# Altium schematic sheet [07] - RS232.SchDoc
size A3; DocumentNumber: 8; SheetNumber: 8; SheetTotal: 12
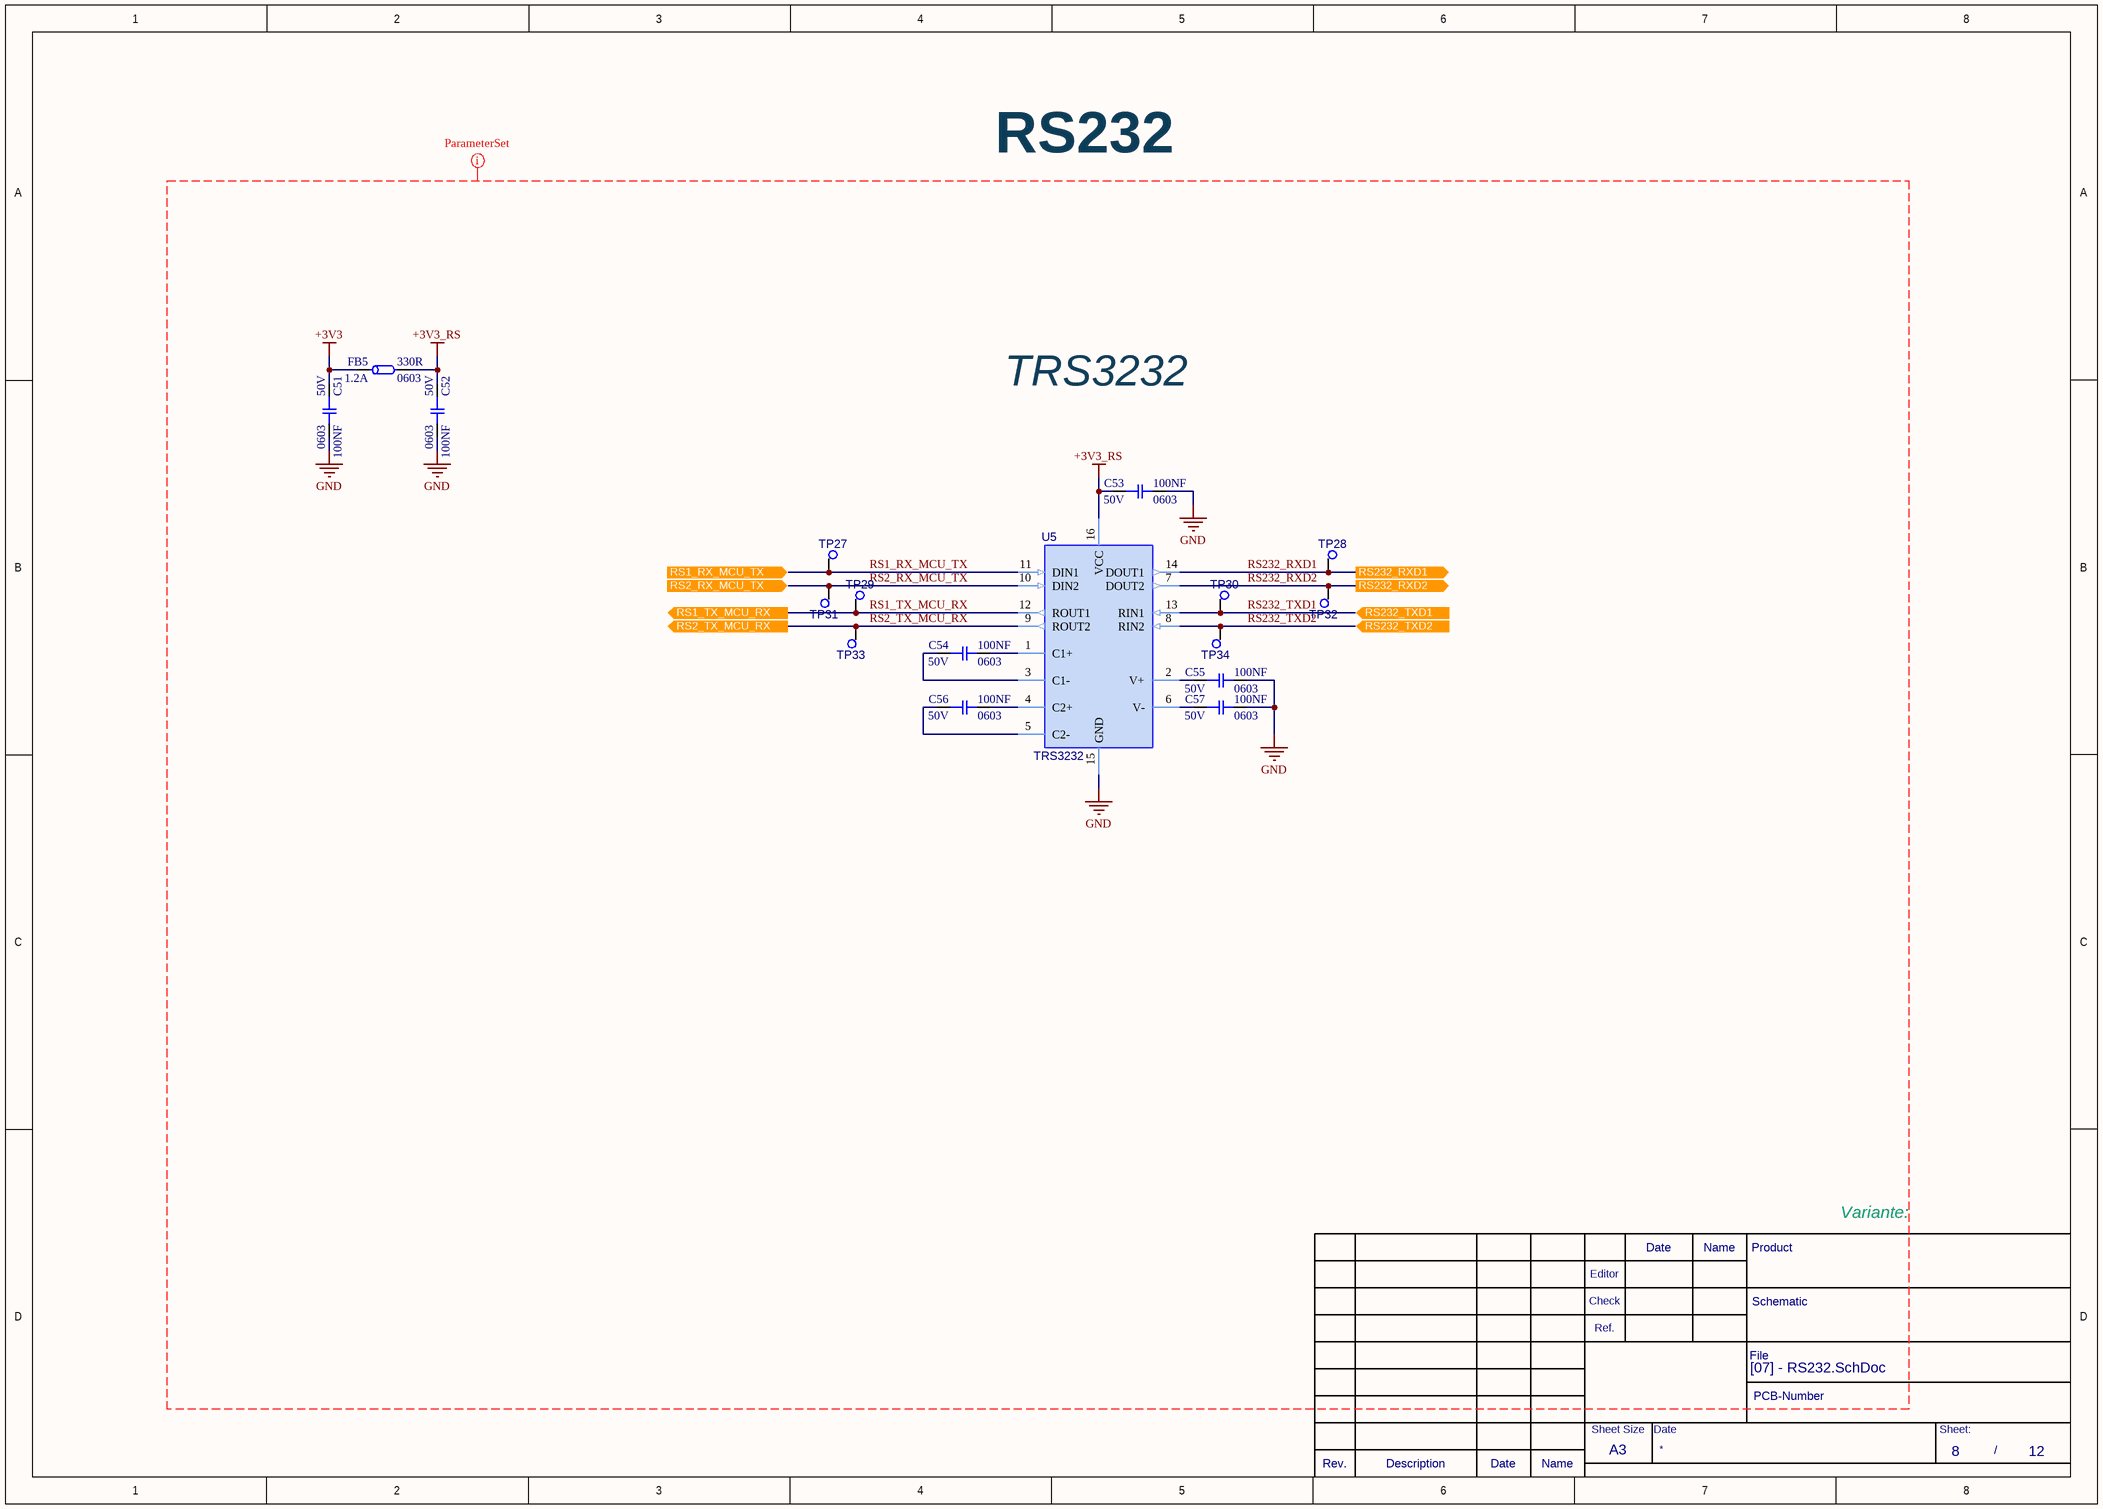
[diagram p0: [07] - RS232.SchDoc]

## Parts
C51  100NF  Voltage Rating: 50V  Case Code (Imperial): 0603  [C-0603]
C52  100NF  Voltage Rating: 50V  Case Code (Imperial): 0603  [C-0603]
C53  100NF  Voltage Rating: 50V  Case Code (Imperial): 0603  [C-0603]
C54  100NF  Voltage Rating: 50V  Case Code (Imperial): 0603  [C-0603]
C55  100NF  Voltage Rating: 50V  Case Code (Imperial): 0603  [C-0603]
C56  100NF  Voltage Rating: 50V  Case Code (Imperial): 0603  [C-0603]
C57  100NF  Voltage Rating: 50V  Case Code (Imperial): 0603  [C-0603]
FB5  330R  Case/Package: 0603  DC Current: 1.2A  [FB-0603]
TP27  MECH-TESTPOINT  [MECH-TESTPOINT]  (value not drawn)  (no BOM)
TP28  MECH-TESTPOINT  [MECH-TESTPOINT]  (value not drawn)  (no BOM)
TP29  MECH-TESTPOINT  [MECH-TESTPOINT]  (value not drawn)  (no BOM)
TP30  MECH-TESTPOINT  [MECH-TESTPOINT]  (value not drawn)  (no BOM)
TP31  MECH-TESTPOINT  [MECH-TESTPOINT]  (value not drawn)  (no BOM)
TP32  MECH-TESTPOINT  [MECH-TESTPOINT]  (value not drawn)  (no BOM)
TP33  MECH-TESTPOINT  [MECH-TESTPOINT]  (value not drawn)  (no BOM)
TP34  MECH-TESTPOINT  [MECH-TESTPOINT]  (value not drawn)  (no BOM)
U5  TRS3232  [TSSOP16]

## Ports
RS1_RX_MCU_TX (in), RS1_TX_MCU_RX (out), RS2_RX_MCU_TX (in), RS2_TX_MCU_RX (out), RS232_RXD1 (out), RS232_RXD2 (out), RS232_TXD1 (in), RS232_TXD2 (in)

## Nets
+3V3: C51.1 FB5.1
+3V3_RS: C52.1 C53.1 FB5.2 U5.16(VCC)
GND: C51.2 C52.2 C53.2 C55.2 C57.2 U5.15(GND)
RS1_RX_MCU_TX: TP27.1 U5.11(DIN1) ; port RS1_RX_MCU_TX
RS1_TX_MCU_RX: TP29.1 U5.12(ROUT1) ; port RS1_TX_MCU_RX
RS2_RX_MCU_TX: TP31.1 U5.10(DIN2) ; port RS2_RX_MCU_TX
RS2_TX_MCU_RX: TP33.1 U5.9(ROUT2) ; port RS2_TX_MCU_RX
RS232_RXD1: TP28.1 U5.14(DOUT1) ; port RS232_RXD1
RS232_RXD2: TP32.1 U5.7(DOUT2) ; port RS232_RXD2
RS232_TXD1: TP30.1 U5.13(RIN1) ; port RS232_TXD1
RS232_TXD2: TP34.1 U5.8(RIN2) ; port RS232_TXD2
NetC54_1: C54.1 U5.3(C1-)
NetC54_2: C54.2 U5.1(C1+)
NetC55_1: C55.1 U5.2(V+)
NetC56_1: C56.1 U5.5(C2-)
NetC56_2: C56.2 U5.4(C2+)
NetC57_1: C57.1 U5.6(V-)

## Layout directives
net class RS232: +3V3, +3V3_RS, GND, RS1_RX_MCU_TX, RS1_TX_MCU_RX, RS2_RX_MCU_TX, RS2_TX_MCU_RX, RS232_RXD1, RS232_RXD2, RS232_TXD1, RS232_TXD2

## Notes on the sheet
- RS232
- TRS3232
- Date
- Name
- Product
- Variante:
- Editor
- Check
- Ref.
- Schematic
- File
- PCB-Number
- Rev.
- Description
- Sheet Size
- A3
- Sheet:
- /

## Library data of the parts
C51-C57 = C-100NF-0603: CAP CER 0.1UF 50V X7R 0603; Manufacturer: TDK; Manufacturer Part Number: C1608X7R1H104K080AA; Tolerance: 10%; Dielectric Material: Ceramic; .PCBCHK: USED; .Creator: F:TALI; Washability: OK; Temperature Coefficient: 30ppm/°C; Mount: Surface Mount; Case/Package: 0603; Case Code (Metric): 1608; Min Operating Temperature: -55°C; Max Operating Temperature: 125°C; Package Quantity: 1; Packaging: Tape and Reel; Features: Soft Termination; Length: 1.6mm; Width: 0.8mm; Thickness: 0.037inch; Lead Free: Lead Free; Capacitance: 100nF; Supplier 1: Digi-Key; Supplier Part Number 1: 445-1314-1-ND; Stock 1: 0; Pricing 1: 1=0.1, 10=0.057, 100=0.0254, 500=0.01812, 1000=0.01423 (USD); Contact Plating: Matte,Tin; Voltage Rating (DC): 50V; Dielectric: X7R; Termination: SMD/SMT; Voltage: 50V; Height: 0.8mm; Depth: 0.8mm; REACH SVHC: No SVHC; ComponentLink1URL: http://www.mouser.com/ds/2/400/lcc_commercial_general_en-837201.pdf; ComponentLink1Description: http://www.mouser.com/ds/2/400/lcc_commercial_general_en-837201.pdf; ComponentLink2URL: https://product.tdk.com/info/en/catalog/spec/mlccspec_commercial_general_midvoltage_en.pdf; ComponentLink2Description: https://product.tdk.com/info/en/catalog/spec/mlccspec_commercial_general_midvoltage_en.pdf; Supplier 2: Digi-Key; Supplier Part Number 2: 478-3540-6-ND; Stock 2: 40000; Pricing 2: 1=0.23, 10=0.161, 100=0.0756, 500=0.05304, 1000=0.0439 (USD); Number of Pins: 2; Radiation Hardening: No; ComponentLink3URL: http://uk.rs-online.com/webdocs/13d1/0900766b813d1103.pdf; ComponentLink3Description: http://uk.rs-online.com/webdocs/13d1/0900766b813d1103.pdf; ComponentLink4URL: http://www.tdk.co.jp/tefe02/e412_c.pdf; ComponentLink4Description: http://www.tdk.co.jp/tefe02/e412_c.pdf; ComponentLink5URL: http://www.farnell.com/datasheets/2291921.pdf; ComponentLink5Description: http://www.farnell.com/datasheets/2291921.pdf; ComponentLink6URL: http://www.farnell.com/datasheets/1744655.pdf; ComponentLink6Description: http://www.farnell.com/datasheets/1744655.pdf; ComponentLink7URL: http://catalogs.avx.com/SurfaceMount.pdf; ComponentLink7Description: http://catalogs.avx.com/SurfaceMount.pdf; ComponentLink8URL: http://www.farnell.com/datasheets/630895.pdf; ComponentLink8Description: http://www.farnell.com/datasheets/630895.pdf; ComponentLink9URL: http://www.avx.com/docs/Catalogs/cx7r.pdf; ComponentLink9Description: http://www.avx.com/docs/Catalogs/cx7r.pdf; ComponentLink10URL: http://www.avx.com/docs/catalogs/cauto.pdf; ComponentLink10Description: http://www.avx.com/docs/catalogs/cauto.pdf; .SCHCHK: USED; Weight: 7.1E-05oz; Composition: Ceramic; ComponentLink11URL: https://www.verical.com/server-webapp/html/getDatasheet?partID=98691; ComponentLink11Description: https://www.verical.com/server-webapp/html/getDatasheet?partID=98691; ComponentLink12URL: https://www.avx.com/docs/Catalogs/flexiterm.pdf; ComponentLink12Description: https://www.avx.com/docs/Catalogs/flexiterm.pdf
FB5 = FB-330R-0603: FERRITE BEAD 330 OHM 0603 1LN; Manufacturer: Murata; Manufacturer Part Number: BLM18PG331SN1D; Material: Steel,Ferrite; Tolerance: 25%; DC Resistance (DCR): 150mR; Number of Lines: 1; Test Frequency: 100MHz; Shielding: Unshielded; Washability: OK; .Creator: M.OZKAN; .PCBCHK: USED; Supplier 1: Digi-Key; RoHS: Yes; Number of Pins: 2; Core Material: Ferrite; Case Code (Metric): 1608; Case Code (Imperial): 0603; Min Operating Temperature: -55°C; Max Operating Temperature: 125°C; Impedance: 330R; Package Quantity: 1; Packaging: Tape and Reel; Current Rating: 1.2A; Max Current Rating: 1.2A; Termination: SMD/SMT; Number of Circuits: 1; Length: 1.75mm; Height: 0.8mm; Width: 0.8mm; Depth: 0.95mm; Radiation Hardening: No; REACH SVHC: No SVHC; Lead Free: Lead Free; ComponentLink1URL: https://datasheet.ciiva.com/6211/enfa0003-6211710.pdf?src-supplier=Digi-Key; ComponentLink1Description: https://datasheet.ciiva.com/6211/enfa0003-6211710.pdf?src-supplier=Digi-Key; Supplier Part Number 1: 490-5222-1-ND; Max DC Current: 1.2A; .SCHCHK: USED; Stock: 106218; Pricing: 1=0.1, 10=0.076, 25=0.0684, 50=0.05, 100=0.0433, 250=0.0342, 500=0.0288, 1000=0.0243 (USD)
TP27-TP34 = MECH-TESTPOINT: .PCBCHK: USED; .Creator: F:TALI; Washability: OK; .SCHCHK: USED
U5 = IC-TRS3232ECPWR: IC TRANSCEIVER FULL 2/2 16TSSOP; Manufacturer 1: Texas Instruments; Number of Receivers: 2; Data Rate: 250Kbps; Max Supply Voltage: 5.5V; Min Supply Voltage: 3V; Nominal Supply Current: 1mA; Logic Function: Transceiver,Receiver; Number of Transceivers: 1; Operating Supply Voltage: 5V; Number of I/Os: 8; Propagation Delay: 0.3us; Simplex/Duplex: Full Duplex; Supplier 1: Digi-Key; RoHS: Yes; Category: RS-232 / RS-422 / RS-485 Interface ICs; Stock 1: 4372; Pricing 1: 1=1,16000, 10=1,03300, 25=0,98000, 100=0,75250, 250=0,66500, 500=0,63000, 1000=0,49000 (USD); Mount: Surface Mount; Case/Package: TSSOP; Number of Pins: 16; Weight: 0.002183oz; Min Operating Temperature: -40°C; Max Operating Temperature: 85°C; Packaging: Tape and Reel; Number of Transmitters: 2; Package Quantity: 1; Number of Drivers: 2; Lead Free: Lead Free; REACH SVHC: No SVHC; ComponentLink1URL: https://datasheet.ciiva.com/7295/1764481-7295873.pdf?src-supplier=Newark; ComponentLink1Description: https://datasheet.ciiva.com/7295/1764481-7295873.pdf?src-supplier=Newark; ComponentLink2URL: https://datasheet.ciiva.com/41461/001187063-da-01-en-ic-multich-rs2-trs3232ecpwr-tssop-16-tid-41461747.pdf?src-supplier=Conrad; ComponentLink2Description: https://datasheet.ciiva.com/41461/001187063-da-01-en-ic-multich-rs2-trs3232ecpwr-tssop-16-tid-41461747.pdf?src-supplier=Conrad; ComponentLink3URL: https://datasheet.ciiva.com/1702/trs3232e-1702920.pdf?src-supplier=Digi-Key; ComponentLink3Description: https://datasheet.ciiva.com/1702/trs3232e-1702920.pdf?src-supplier=Digi-Key; ComponentLink4URL: https://datasheet.ciiva.com/1702/trs3232e-1702921.pdf?src-supplier=Digi-Key; ComponentLink4Description: https://datasheet.ciiva.com/1702/trs3232e-1702921.pdf?src-supplier=Digi-Key; ComponentLink5URL: https://datasheet.ciiva.com/1702/trs3232e-1702875.pdf?src-supplier=Digi-Key; ComponentLink5Description: https://datasheet.ciiva.com/1702/trs3232e-1702875.pdf?src-supplier=Digi-Key; ComponentLink6URL: https://datasheet.ciiva.com/41677/1838938-41677467.pdf?src-supplier=Newark; ComponentLink6Description: https://datasheet.ciiva.com/41677/1838938-41677467.pdf?src-supplier=Newark; ComponentLink7URL: https://datasheet.ciiva.com/46436/1838938-46436111.pdf?src-supplier=Element14; ComponentLink7Description: https://datasheet.ciiva.com/46436/1838938-46436111.pdf?src-supplier=Element14; Supplier Part Number 1: 296-22596-1-ND; Manufacturer Part Number 1: TRS3232ECPWR